# Altium project STM32F407ZGT6.PrjPcb
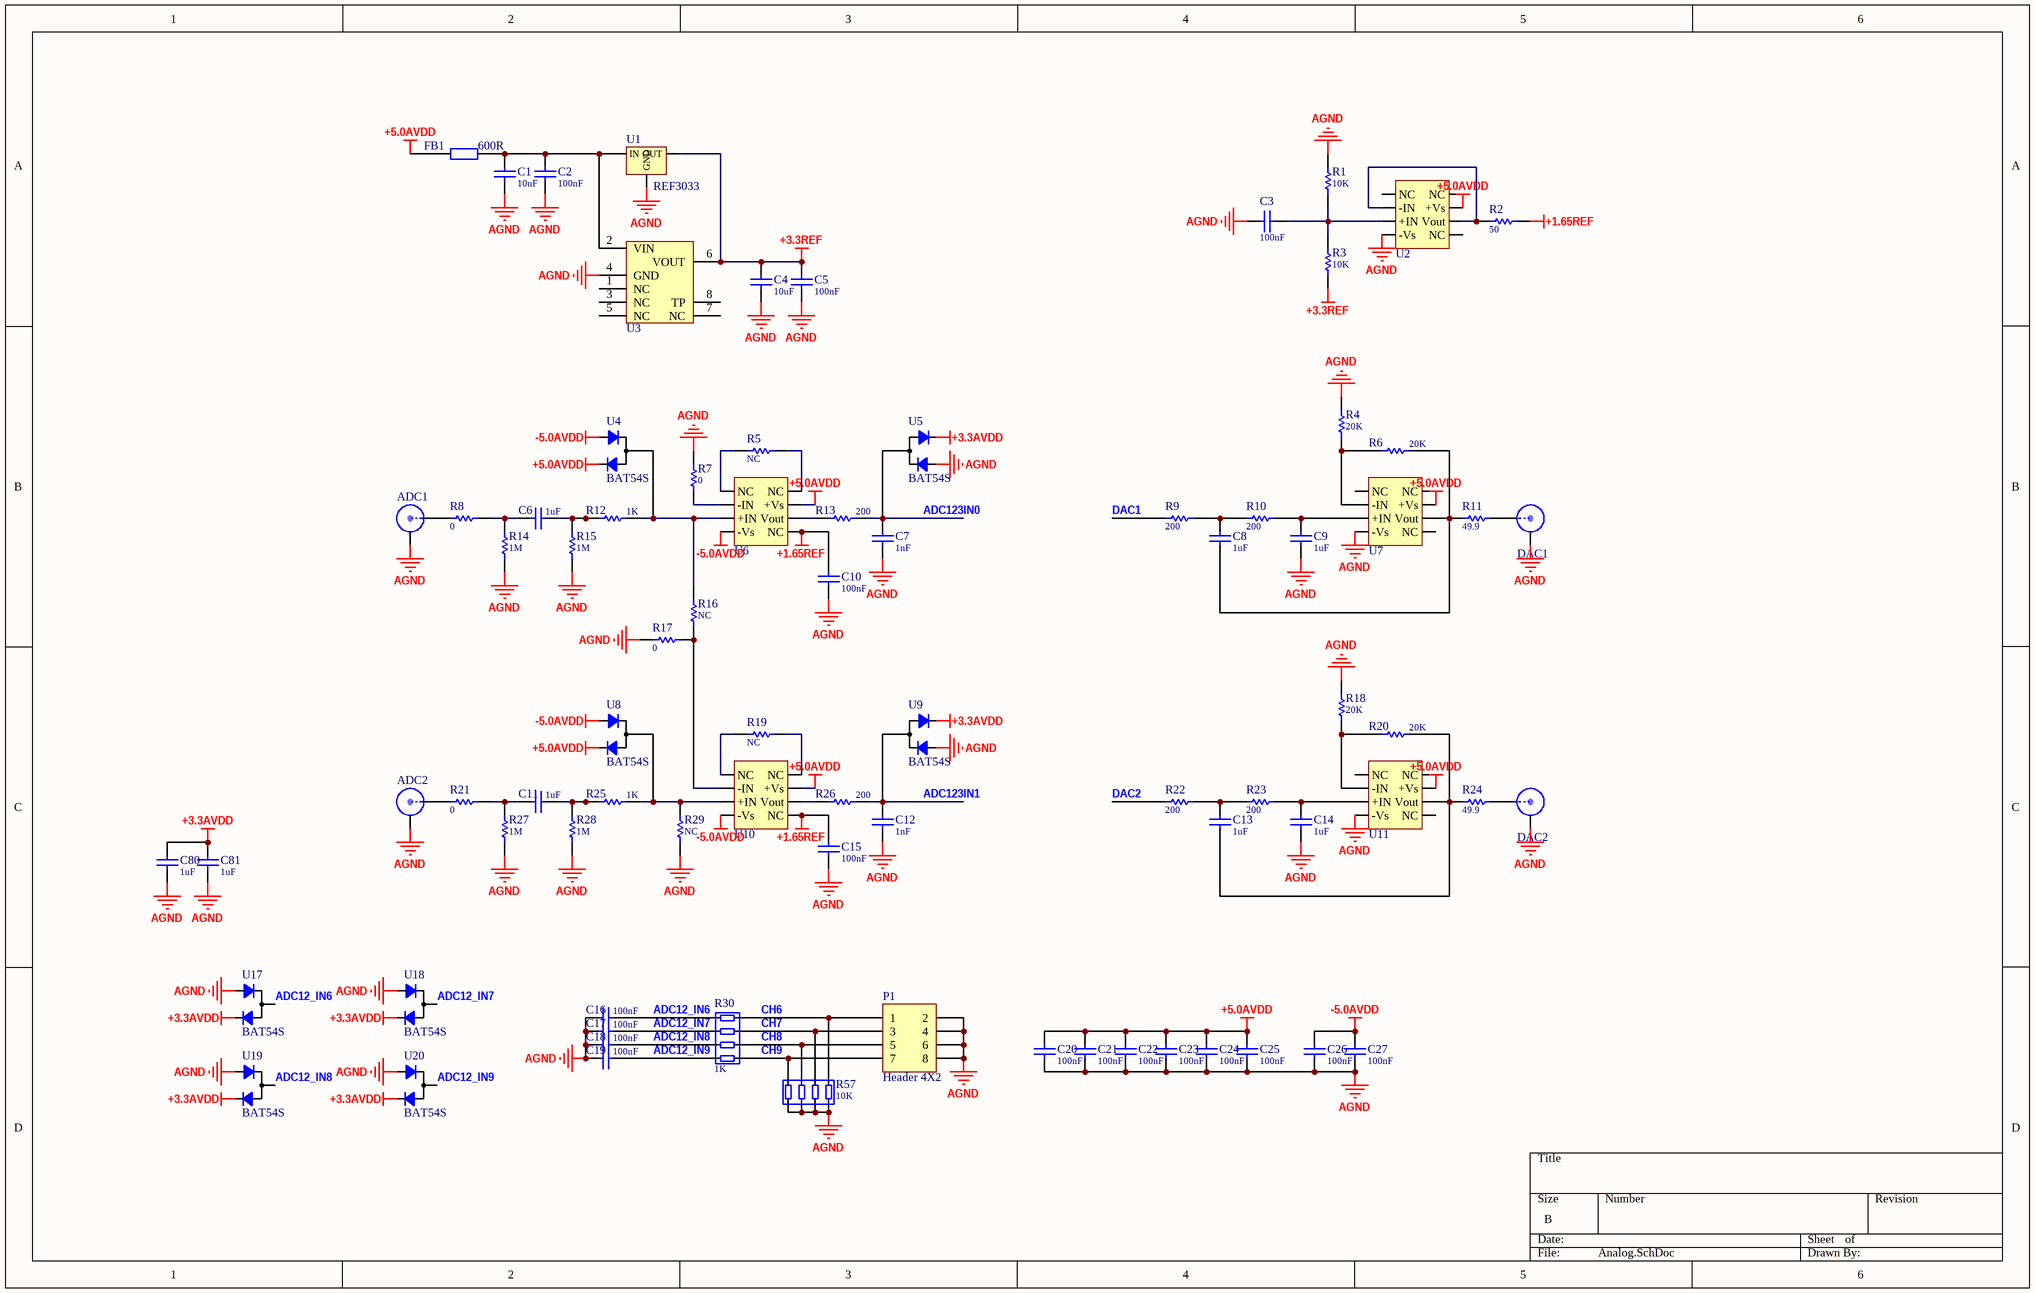
[diagram p0: Analog.SchDoc]
4 sheets, 225 parts. Net scope: global (net labels, ports and power ports of the same name join across sheets).
Board file: STM32F407ZGT6.PcbDoc
Sheets:
  Analog.SchDoc
  Power.SchDoc
  STM32F407ZGT6.SchDoc
  Ports.SchDoc

## Sheet Analog.SchDoc
size B

### Parts
ADC1  SMA  [SMA_ANGLE]  (value not drawn)
ADC2  SMA  [SMA_ANGLE]  (value not drawn)
C1  value 10uF  [C0603-L]  (hidden comment: Cap-S)
C2  value 100nF  [C0603-L]  (hidden comment: Cap-S)
C3  value 100nF  [C0603-L]  (hidden comment: Cap-S)
C4  value 10uF  [C0603-L]  (hidden comment: Cap-S)
C5  value 100nF  [C0603-L]  (hidden comment: Cap-S)
C6  value 1uF  [C0603-L]  (hidden comment: Cap-S)
C7  value 1nF  [C0603-L]  (hidden comment: Cap-S)
C8  value 1uF  [C0603-L]  (hidden comment: Cap-S)
C9  value 1uF  [C0603-L]  (hidden comment: Cap-S)
C10  value 100nF  [C0603-L]  (hidden comment: Cap-S)
C11  value 1uF  [C0603-L]  (hidden comment: Cap-S)
C12  value 1nF  [C0603-L]  (hidden comment: Cap-S)
C13  value 1uF  [C0603-L]  (hidden comment: Cap-S)
C14  value 1uF  [C0603-L]  (hidden comment: Cap-S)
C15  value 100nF  [C0603-L]  (hidden comment: Cap-S)
C16  value 100nF  [C0603-L]  (hidden comment: Cap-S)
C17  value 100nF  [C0603-L]  (hidden comment: Cap-S)
C18  value 100nF  [C0603-L]  (hidden comment: Cap-S)
C19  value 100nF  [C0603-L]  (hidden comment: Cap-S)
C20  value 100nF  [C0603-L]  (hidden comment: Cap-S)
C21  value 100nF  [C0603-L]  (hidden comment: Cap-S)
C22  value 100nF  [C0603-L]  (hidden comment: Cap-S)
C23  value 100nF  [C0603-L]  (hidden comment: Cap-S)
C24  value 100nF  [C0603-L]  (hidden comment: Cap-S)
C25  value 100nF  [C0603-L]  (hidden comment: Cap-S)
C26  value 100nF  [C0603-L]  (hidden comment: Cap-S)
C27  value 100nF  [C0603-L]  (hidden comment: Cap-S)
C80  value 1uF  [C0603-L]  (hidden comment: Cap-S)
C81  value 1uF  [C0603-L]  (hidden comment: Cap-S)
DAC1  SMA  [SMA_ANGLE]  (value not drawn)
DAC2  SMA  [SMA_ANGLE]  (value not drawn)
FB1  600R  [FB-0805]
P1  Header 4X2  [HDR2X4]
R1  value 10K  [R0603-L]  (hidden comment: R)
R2  value 50  [R0603-L]  (hidden comment: R)
R3  value 10K  [R0603-L]  (hidden comment: R)
R4  value 20K  [R0603-L]  (hidden comment: R)
R5  value NC  [R0603-L]  (hidden comment: R)
R6  value 20K  [R0603-L]  (hidden comment: R)
R7  value 0  [R0603-L]  (hidden comment: R)
R8  value 0  [R0603-L]  (hidden comment: R)
R9  value 200  [R0603-L]  (hidden comment: R)
R10  value 200  [R0603-L]  (hidden comment: R)
R11  value 49.9  [R0603-L]  (hidden comment: R)
R12  value 1K  [R0603-L]  (hidden comment: R)
R13  value 200  [R0603-L]  (hidden comment: R)
R14  value 1M  [R0603-L]  (hidden comment: R)
R15  value 1M  [R0603-L]  (hidden comment: R)
R16  value NC  [R0603-L]  (hidden comment: R)
R17  value 0  [R0603-L]  (hidden comment: R)
R18  value 20K  [R0603-L]  (hidden comment: R)
R19  value NC  [R0603-L]  (hidden comment: R)
R20  value 20K  [R0603-L]  (hidden comment: R)
R21  value 0  [R0603-L]  (hidden comment: R)
R22  value 200  [R0603-L]  (hidden comment: R)
R23  value 200  [R0603-L]  (hidden comment: R)
R24  value 49.9  [R0603-L]  (hidden comment: R)
R25  value 1K  [R0603-L]  (hidden comment: R)
R26  value 200  [R0603-L]  (hidden comment: R)
R27  value 1M  [R0603-L]  (hidden comment: R)
R28  value 1M  [R0603-L]  (hidden comment: R)
R29  value NC  [R0603-L]  (hidden comment: R)
R30  value 1K  [R0603X4]  (hidden comment: R)
R57  value 10K  [R0603X4]  (hidden comment: R)
U1  REF3033  [SOT23-3_N]
U2  OPA657  [SOIC-8_N]  (value not drawn)
U3  ADR45xx  [SOIC-8_N]  (value not drawn)
U4  BAT54S  [SOT-23-3]
U5  BAT54S  [SOT-23-3]
U6  OPA657  [SOIC-8_N]  (value not drawn)
U7  OPA657  [SOIC-8_N]  (value not drawn)
U8  BAT54S  [SOT-23-3]
U9  BAT54S  [SOT-23-3]
U10  OPA657  [SOIC-8_N]  (value not drawn)
U11  OPA657  [SOIC-8_N]  (value not drawn)
U17  BAT54S  [SOT-23-3]
U18  BAT54S  [SOT-23-3]
U19  BAT54S  [SOT-23-3]
U20  BAT54S  [SOT-23-3]

### Nets
+1.65REF: C10.1 C15.1 R2.1 U6.5(NC) U10.5(NC)
+3.3AVDD: C80.1 C81.1 U5.3 U9.3 U17.3 U18.3 U19.3 U20.3
+3.3REF: C4.2 C5.2 R3.1 U1.2(OUT) U3.6(VOUT)
+5.0AVDD: C20.1 C21.1 C22.1 C23.1 C24.1 C25.1 FB1.1 U2.7(+Vs) U4.3 U6.7(+Vs) U7.7(+Vs) U8.3 U10.7(+Vs) U11.7(+Vs)
-5.0AVDD: C26.1 C27.1 U4.1 U6.4(-Vs) U8.1 U10.4(-Vs)
AGND: ADC1.2 ADC2.2 C1.1 C2.1 C3.2 C4.1 C5.1 C7.1 C9.2 C10.2 C12.1 C14.2 C15.2 C16.2 C17.2 C18.2 C19.2 C20.2 C21.2 C22.2 C23.2 C24.2 C25.2 C26.2 C27.2 C80.2 C81.2 DAC1.2 DAC2.2 P1.2 P1.4 P1.6 P1.8 R1.2 R4.2 R7.2 R14.1 R15.1 R17.2 R18.2 R27.1 R28.1 R29.2 R57.5 R57.6 R57.7 R57.8 U1.3(GND) U2.4(-Vs) U3.4(GND) U5.1 U7.4(-Vs) U9.1 U11.4(-Vs) U17.1 U18.1 U19.1 U20.1
ADC12_IN6: C16.1 R30.8 U17.2
ADC12_IN7: C17.1 R30.7 U18.2
ADC12_IN8: C18.1 R30.6 U19.2
ADC12_IN9: C19.1 R30.5 U20.2
ADC123IN0: C7.2 R13.2 U5.2
ADC123IN1: C12.2 R26.2 U9.2
CH6: P1.1 R30.1 R57.4
CH7: P1.3 R30.2 R57.3
CH8: P1.5 R30.3 R57.2
CH9: P1.7 R30.4 R57.1
DAC1: R9.2
DAC2: R22.2
NetADC1_1: ADC1.1 R8.2
NetADC2_1: ADC2.1 R21.2
NetC1_2: C1.2 C2.2 FB1.2 U1.1(IN) U3.2(VIN)
NetC3_1: C3.1 R1.1 R3.2 U2.3(+IN)
NetC6_1: C6.1 R12.1 R15.2
NetC6_2: C6.2 R8.1 R14.2
NetC8_1: C8.1 R9.1 R10.2
NetC8_2: C8.2 R6.2 R11.2 U7.6(Vout)
NetC9_1: C9.1 R10.1 U7.3(+IN)
NetC11_1: C11.1 R25.1 R28.2
NetC11_2: C11.2 R21.1 R27.2
NetC13_1: C13.1 R22.1 R23.2
NetC13_2: C13.2 R20.2 R24.2 U11.6(Vout)
NetC14_1: C14.1 R23.1 U11.3(+IN)
NetDAC1_1: DAC1.1 R11.1
NetDAC2_1: DAC2.1 R24.1
NetR2_2: R2.2 U2.2(-IN) U2.6(Vout)
NetR4_1: R4.1 R6.1 U7.2(-IN)
NetR5_1: R5.1 U6.8(NC)
NetR5_2: R5.2 U6.1(NC)
NetR7_1: R7.1 U6.2(-IN)
NetR12_2: R12.2 R16.2 U4.2 U6.3(+IN)
NetR13_1: R13.1 U6.6(Vout)
NetR16_1: R16.1 R17.1 U10.2(-IN)
NetR18_1: R18.1 R20.1 U11.2(-IN)
NetR19_1: R19.1 U10.8(NC)
NetR19_2: R19.2 U10.1(NC)
NetR25_2: R25.2 R29.1 U8.2 U10.3(+IN)
NetR26_1: R26.1 U10.6(Vout)

Not connected (* = marked no-connect by the designer): U2 1(NC) 5(NC) 8(NC); U3 1(NC) 3(NC) 5(NC) 7(NC) 8(TP); U7 1(NC) 5(NC) 8(NC); U11 1(NC) 5(NC) 8(NC)

### Library data of the parts
C1-C27 C80 C81 = Cap-S: 贴片瓷片电容
FB1 = FB
P1 = Header 4X2: Header, 4-Pin, Dual row; LatestRevisionDate: 17-Jul-2002; LatestRevisionNote: Re-released for DXP Platform.; Publisher: Altium Limited
R1-R29 = Res: 贴片电阻
R30 R57 = Res-4R: 排阻 4
U1 = REF3025: 采用 SOT23-3 封装的 2.5V 输出 50ppm/℃ 漂移 50uA 静态电流的（带隙）电压参考
U2 U6 U7 U10 U11 = OPA657: 1.6-GHz, Low-Noise, FET-Input Operational Amplifier; Manufacturer: Texas Instruments; PartNumber: OPA656U; 2nd Harmonic(dBc): 74; 3rd Harmonic(dBc): 100; @ MHz: 5; Acl, min stable gain(V/V): 1; BW @ Acl(MHz): 500; Diff Gain(%): 0.02; Diff Phase(deg): 0.05; Eco-Plan: Green (RoHS & no Sb/Br); Io(Typ)(mA): 70; Iq per channel(Max)(mA): 16; Slew Rate(Typ)(V/us): 290; Sub Family: High Output Current Amplifier (>=50mA), High Speed Amplifier (>=50MHz), Low Input Bias Current Amp (<=10pA); THD (Fc is 1 MHz)(Typ)(dB): -74; Vio(Max)(mV): 0.6; Vn at Flatband(Typ)(nV/rtHz): 7; Vs(Max)(V): 12; Vs(Min)(V): 10; DatasheetVersion: SBOS196G; PackageVersion: 4040047-3/M, 06/2011; PackageReference: D8; PackageDescription: 8-Pin Plastic Small Outline, Body 4.9 x 3.9 mm, Pitch 1.27 mm; Supplier 1: Digi-Key; Supplier Part Number 1: OPA656U-ND; Supplier 2: Farnell; Supplier Part Number 2: 1212322; Supplier 3: Newark; Supplier Part Number 3: 75C5137; Supplier 4: Mouser; Supplier Part Number 4: 595-OPA656U; Iib(Max)(nA): 0.02; Number of Channels: 1; Settling Time (0.1%)(Typ)(ns): 16; Mounting Technology: Surface Mount; Code_JEDEC: MS-012; ComponentLink1Description: Manufacturer URL; ComponentLink1URL: http://www.ti.com/; ComponentLink2Description: Datasheet; ComponentLink2URL: http://www.ti.com/general/docs/lit/getliterature.tsp?genericPartNumber=OPA656&fileType=pdf; ComponentLink3Description: Package Specification; ComponentLink3URL: http://www.ti.com/litv/pdf/msoi002j
U3 = ADR45xx: 超低噪声、高精度  基准电压源

## Sheet Power.SchDoc
size A4
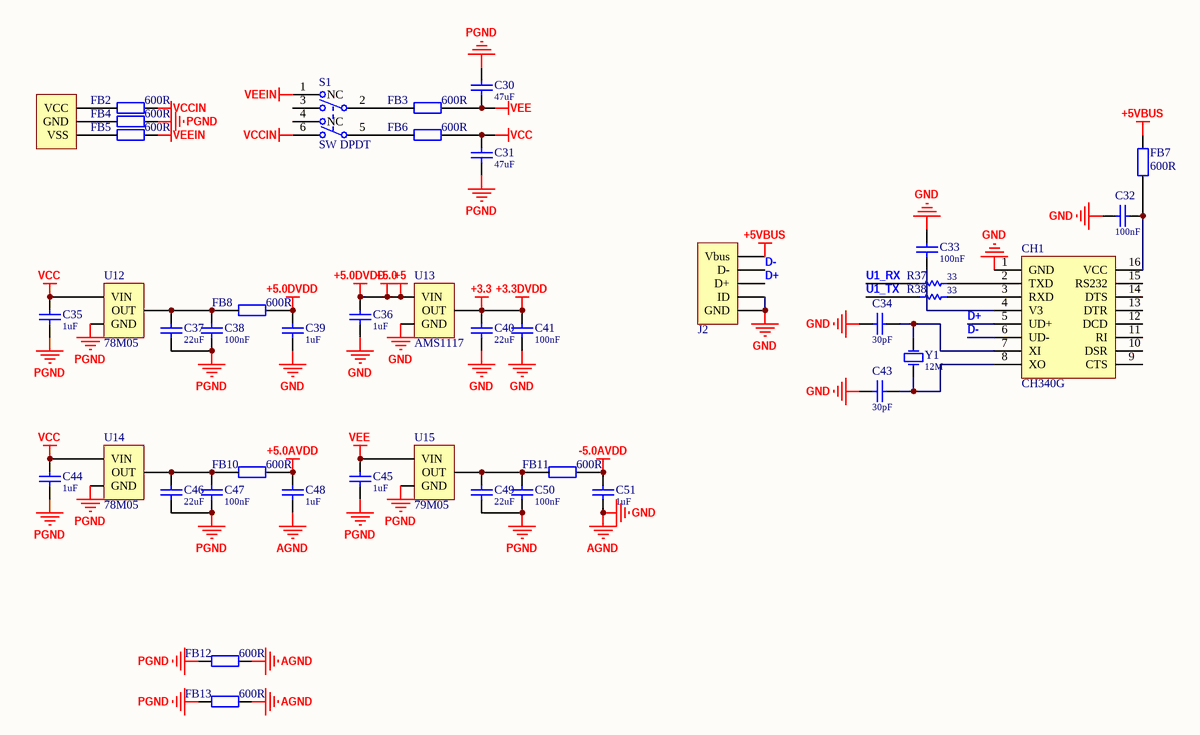
[diagram p1: Power.SchDoc]

### Parts
C30  value 47uF  [C0805-L]  (hidden comment: Cap-S)
C31  value 47uF  [C0805-L]  (hidden comment: Cap-S)
C32  value 100nF  [C0603-L]  (hidden comment: Cap-S)
C33  value 100nF  [C0603-L]  (hidden comment: Cap-S)
C34  value 30pF  [C0603-L]  (hidden comment: Cap-S)
C35  value 1uF  [C0603-L]  (hidden comment: Cap-S)
C36  value 1uF  [C0603-L]  (hidden comment: Cap-S)
C37  value 22uF  [C0805-L]  (hidden comment: Cap-S)
C38  value 100nF  [C0603-L]  (hidden comment: Cap-S)
C39  value 1uF  [C0603-L]  (hidden comment: Cap-S)
C40  value 22uF  [C0805-L]  (hidden comment: Cap-S)
C41  value 100nF  [C0603-L]  (hidden comment: Cap-S)
C43  value 30pF  [C0603-L]  (hidden comment: Cap-S)
C44  value 1uF  [C0603-L]  (hidden comment: Cap-S)
C45  value 1uF  [C0603-L]  (hidden comment: Cap-S)
C46  value 22uF  [C0805-L]  (hidden comment: Cap-S)
C47  value 100nF  [C0603-L]  (hidden comment: Cap-S)
C48  value 1uF  [C0603-L]  (hidden comment: Cap-S)
C49  value 22uF  [C0805-L]  (hidden comment: Cap-S)
C50  value 100nF  [C0603-L]  (hidden comment: Cap-S)
C51  value 1uF  [C0603-L]  (hidden comment: Cap-S)
CH1  CH340G  [SOP-16]
FB2  600R  [FB-0805]
FB3  600R  [FB-0805]
FB4  600R  [FB-0805]
FB5  600R  [FB-0805]
FB6  600R  [FB-0805]
FB7  600R  [FB-0805]
FB8  600R  [FB-0805]
FB10  600R  [FB-0805]
FB11  600R  [FB-0805]
FB12  600R  [FB-0805]
FB13  600R  [FB-0805]
J1  Power-3P  [SIPA03]  (value not drawn)
J2  USB_Mini/Micro  [USB_MINI_B-L]  (value not drawn)
R37  value 33  [R0603-L]  (hidden comment: R)
R38  value 33  [R0603-L]  (hidden comment: R)
S1  SW DPDT  [SW_DPDT]
U12  78M05  [TO-252]
U13  AMS1117  [SOT-223]
U14  78M05  [TO-252]
U15  79M05  [TO-252]
Y1  value 12M  [XTAL-PB2-SMD]  (hidden comment: XTAL)

### Nets
+3.3: C40.2 C41.2 U13.2(OUT)  [also labelled +3.3DVDD]
+5: C36.2 C39.2 FB8.2 U13.3(VIN)  [also labelled +5.0, +5.0DVDD]
+5.0AVDD: C48.2 FB10.2
+5VBUS: FB7.2 J2.1(Vbus)
-5.0AVDD: C51.2 FB11.2
AGND: C32.1 C33.1 C34.1 C36.1 C39.1 C40.1 C41.1 C43.1 C48.1 C51.1 CH1.1(GND) FB12.2 FB13.2 J2.4(ID) J2.5(GND) U13.1(GND)  [also labelled GND]
PGND: C30.2 C31.2 C35.1 C37.1 C38.1 C44.1 C45.1 C46.1 C47.1 C49.1 C50.1 FB4.2 FB12.1 FB13.1 U12.2(GND) U14.2(GND) U15.1(GND)
VCC: C31.1 C35.2 C44.2 FB6.2 U12.1(VIN) U14.1(VIN)
VCCIN: FB2.2 S1.6(NO2)
VEE: C30.1 C45.2 FB3.2 U15.2(VIN)
VEEIN: FB5.2 S1.1(NC)
D+: CH1.5(UD+) J2.3(D+)
D-: CH1.6(UD-) J2.2(D-)
U1_RX: R37.1
U1_TX: R38.1
NetC32_2: C32.2 CH1.16(VCC) FB7.1
NetC33_2: C33.2 CH1.4(V3)
NetC34_2: C34.2 CH1.7(XI) Y1.2(OSC2)
NetC37_2: C37.2 C38.2 FB8.1 U12.3(OUT)
NetC43_2: C43.2 CH1.8(XO) Y1.1(OSC1)
NetC46_2: C46.2 C47.2 FB10.1 U14.3(OUT)
NetC49_2: C49.2 C50.2 FB11.1 U15.3(OUT)
NetCH1_2: CH1.2(TXD) R37.2
NetCH1_3: CH1.3(RXD) R38.2
NetFB2_1: FB2.1 J1.1(VCC)
NetFB3_1: FB3.1 S1.2
NetFB4_1: FB4.1 J1.2(GND)
NetFB5_1: FB5.1 J1.3(VSS)
NetFB6_1: FB6.1 S1.5(COMMON2)

Not connected (* = marked no-connect by the designer): CH1 9(CTS) 10(DSR) 11(RI) 12(DCD) 13(DTR) 14(DTS) 15(RS232); S1 3(NO1) 4(NC)

### Library data of the parts
C30-C41 C43-C51 = Cap-S: 贴片瓷片电容
CH1 = CH340G: SOP16
FB2-FB8 FB10-FB13 = FB
J1 = Power-3P: 供电端子
J2 = USB: Mini/Micro USB母口
R37 R38 = Res: 贴片电阻
S1 = SW DPDT: 自锁开关; Published: 24-Mar-1999; LatestRevisionDate: 29-May-2009; LatestRevisionNote: IPC-7351 Footprint Added.; PackageVersion: Mar-2001; PackageReference: SOT23-6; Publisher: Altium Limited; PackageDescription: 6-Pin SOT-23 Package 0.95 mm Pitch, 2.7 mm Lead Span; Code_JEITA: SC-74; Code_IPC: SOT26A-6
Y1 = XTAL: 晶振

## Sheet STM32F407ZGT6.SchDoc
size C
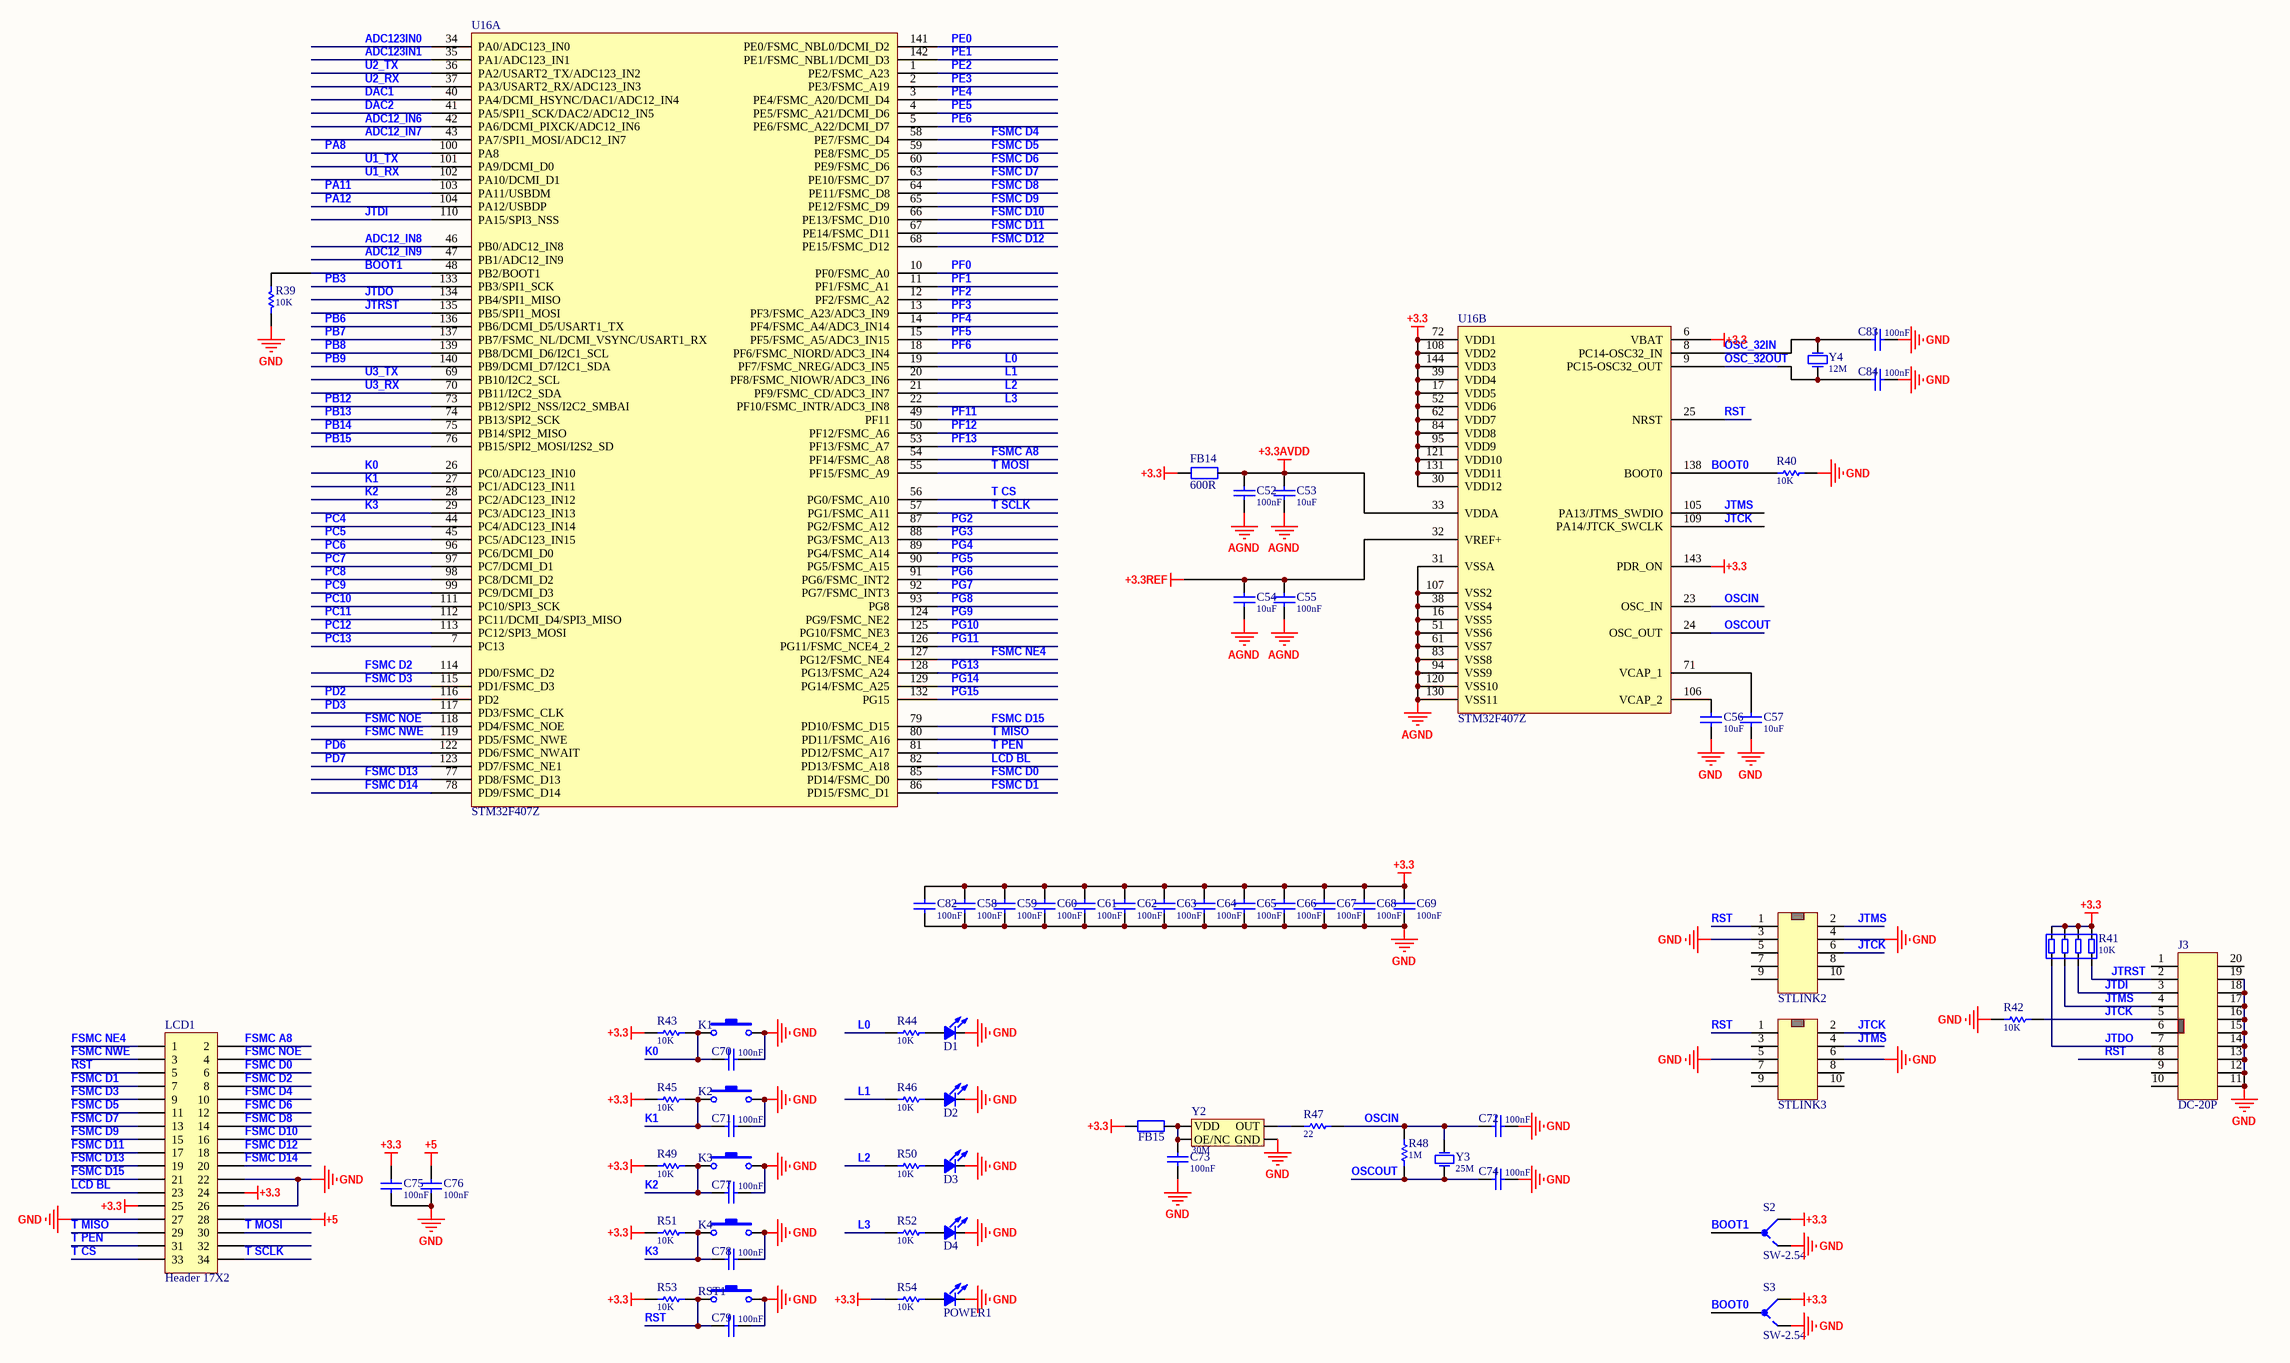
[diagram p2: STM32F407ZGT6.SchDoc]

### Parts
C52  value 100nF  [C0603-L]  (hidden comment: Cap-S)
C53  value 10uF  [C0603-L]  (hidden comment: Cap-S)
C54  value 10uF  [C0603-L]  (hidden comment: Cap-S)
C55  value 100nF  [C0603-L]  (hidden comment: Cap-S)
C56  value 10uF  [C0603-L]  (hidden comment: Cap-S)
C57  value 10uF  [C0603-L]  (hidden comment: Cap-S)
C58  value 100nF  [C0603-L]  (hidden comment: Cap-S)
C59  value 100nF  [C0603-L]  (hidden comment: Cap-S)
C60  value 100nF  [C0603-L]  (hidden comment: Cap-S)
C61  value 100nF  [C0603-L]  (hidden comment: Cap-S)
C62  value 100nF  [C0603-L]  (hidden comment: Cap-S)
C63  value 100nF  [C0603-L]  (hidden comment: Cap-S)
C64  value 100nF  [C0603-L]  (hidden comment: Cap-S)
C65  value 100nF  [C0603-L]  (hidden comment: Cap-S)
C66  value 100nF  [C0603-L]  (hidden comment: Cap-S)
C67  value 100nF  [C0603-L]  (hidden comment: Cap-S)
C68  value 100nF  [C0603-L]  (hidden comment: Cap-S)
C69  value 100nF  [C0603-L]  (hidden comment: Cap-S)
C70  value 100nF  [C0603-L]  (hidden comment: Cap-S)
C71  value 100nF  [C0603-L]  (hidden comment: Cap-S)
C72  value 100nF  [C0603-L]  (hidden comment: Cap-S)
C73  value 100nF  [C0603-L]  (hidden comment: Cap-S)
C74  value 100nF  [C0603-L]  (hidden comment: Cap-S)
C75  value 100nF  [C0603-L]  (hidden comment: Cap-S)
C76  value 100nF  [C0603-L]  (hidden comment: Cap-S)
C77  value 100nF  [C0603-L]  (hidden comment: Cap-S)
C78  value 100nF  [C0603-L]  (hidden comment: Cap-S)
C79  value 100nF  [C0603-L]  (hidden comment: Cap-S)
C82  value 100nF  [C0603-L]  (hidden comment: Cap-S)
C83  value 100nF  [C0603-L]  (hidden comment: Cap-S)
C84  value 100nF  [C0603-L]  (hidden comment: Cap-S)
D1  LED  [Led-0805_M]  (value not drawn)
D2  LED  [Led-0805_M]  (value not drawn)
D3  LED  [Led-0805_M]  (value not drawn)
D4  LED  [Led-0805_M]  (value not drawn)
FB14  600R  [FB-0603]
FB15  FB  [FB0805]  (value not drawn)
J3  DC-20P  [DC-20P]
K1  SW-PB2  [SW-PB2-SMD]  (value not drawn)
K2  SW-PB2  [SW-PB2-SMD]  (value not drawn)
K3  SW-PB2  [SW-PB2-SMD]  (value not drawn)
K4  SW-PB2  [SW-PB2-SMD]  (value not drawn)
LCD1  Header 17X2  [HDR2X17]
POWER1  LED  [Led-0805_M]  (value not drawn)
R39  value 10K  [R0603-L]  (hidden comment: R)
R40  value 10K  [R0603-L]  (hidden comment: R)
R41  value 10K  [R0603X4]  (hidden comment: R)
R42  value 10K  [R0603-L]  (hidden comment: R)
R43  value 10K  [R0603-L]  (hidden comment: R)
R44  value 10K  [R0603-L]  (hidden comment: R)
R45  value 10K  [R0603-L]  (hidden comment: R)
R46  value 10K  [R0603-L]  (hidden comment: R)
R47  value 22  [R0603-L]  (hidden comment: R)
R48  value 1M  [R0603-L]  (hidden comment: R)
R49  value 10K  [R0603-L]  (hidden comment: R)
R50  value 10K  [R0603-L]  (hidden comment: R)
R51  value 10K  [R0603-L]  (hidden comment: R)
R52  value 10K  [R0603-L]  (hidden comment: R)
R53  value 10K  [R0603-L]  (hidden comment: R)
R54  value 10K  [R0603-L]  (hidden comment: R)
RST1  SW-PB2  [SW-PB2-SMD]  (value not drawn)
S2  SW-2.54  [SW-2.54-3PDIP]
S3  SW-2.54  [SW-2.54-3PDIP]
STLINK2  JTAG  [JTAG-2.56_10]  (value not drawn)
STLINK3  JTAG  [JTAG-2.56_10]  (value not drawn)
U16  STM32F407Z  [TQFP-144]  (parts A,B of 2)
Y2  value 30M  [XTAL-7050_M]  (hidden comment: XTALS)
Y3  value 25M  [XTAL-PB2-SMD]  (hidden comment: XTAL)
Y4  value 12M  [XTAL-32768]  (hidden comment: XTAL)

### Nets
+3.3: C58.2 C59.2 C60.2 C61.2 C62.2 C63.2 C64.2 C65.2 C66.2 C67.2 C68.2 C69.2 C75.2 C82.2 FB14.2 FB15.1 LCD1.24 LCD1.25 R41.5 R41.6 R41.7 R41.8 R43.1 R45.1 R49.1 R51.1 R53.1 R54.1 S2.1 S3.1 U16.6(VBAT) U16.17(VDD5) U16.30(VDD12) U16.39(VDD4) U16.52(VDD6) U16.62(VDD7) U16.72(VDD1) U16.84(VDD8) U16.95(VDD9) U16.108(VDD2) U16.121(VDD10) U16.131(VDD11) U16.143(PDR_ON) U16.144(VDD3)
+3.3AVDD: C52.2 C53.2 FB14.1 U16.33(VDDA)
+3.3REF: C54.2 C55.2 U16.32(VREF+)
+5: C76.2 LCD1.28
AGND: C52.1 C53.1 C54.1 C55.1 C56.1 C57.1 C58.1 C59.1 C60.1 C61.1 C62.1 C63.1 C64.1 C65.1 C66.1 C67.1 C68.1 C69.1 C70.1 C71.1 C72.1 C73.2 C74.1 C75.1 C76.1 C77.1 C78.1 C79.1 C82.1 C83.1 C84.1 D1.2 D2.2 D3.2 D4.2 J3.11 J3.12 J3.13 J3.14 J3.15 J3.16 J3.17 J3.18 J3.19 K1.2 K2.2 K3.2 K4.2 LCD1.22 LCD1.26 LCD1.27 POWER1.2 R39.1 R40.1 R42.2 RST1.2 S2.3 S3.3 STLINK2.3 STLINK2.4 STLINK3.5 STLINK3.6 U16.16(VSS5) U16.31(VSSA) U16.38(VSS4) U16.51(VSS6) U16.61(VSS7) U16.83(VSS8) U16.94(VSS9) U16.107(VSS2) U16.120(VSS10) U16.130(VSS11) Y2.2(GND)  [also labelled GND]
ADC12_IN6: U16.42(PA6/DCMI_PIXCK/ADC12_IN6)
ADC12_IN7: U16.43(PA7/SPI1_MOSI/ADC12_IN7)
ADC12_IN8: U16.46(PB0/ADC12_IN8)
ADC12_IN9: U16.47(PB1/ADC12_IN9)
ADC123IN0: U16.34(PA0/ADC123_IN0)
ADC123IN1: U16.35(PA1/ADC123_IN1)
BOOT0: R40.2 S3.2 U16.138(BOOT0)
BOOT1: R39.2 S2.2 U16.48(PB2/BOOT1)
DAC1: U16.40(PA4/DCMI_HSYNC/DAC1/ADC12_IN4)
DAC2: U16.41(PA5/SPI1_SCK/DAC2/ADC12_IN5)
FSMC A8: LCD1.2 U16.54(PF14/FSMC_A8)
FSMC D0: LCD1.6 U16.85(PD14/FSMC_D0)
FSMC D1: LCD1.7 U16.86(PD15/FSMC_D1)
FSMC D2: LCD1.8 U16.114(PD0/FSMC_D2)
FSMC D3: LCD1.9 U16.115(PD1/FSMC_D3)
FSMC D4: LCD1.10 U16.58(PE7/FSMC_D4)
FSMC D5: LCD1.11 U16.59(PE8/FSMC_D5)
FSMC D6: LCD1.12 U16.60(PE9/FSMC_D6)
FSMC D7: LCD1.13 U16.63(PE10/FSMC_D7)
FSMC D8: LCD1.14 U16.64(PE11/FSMC_D8)
FSMC D9: LCD1.15 U16.65(PE12/FSMC_D9)
FSMC D10: LCD1.16 U16.66(PE13/FSMC_D10)
FSMC D11: LCD1.17 U16.67(PE14/FSMC_D11)
FSMC D12: LCD1.18 U16.68(PE15/FSMC_D12)
FSMC D13: LCD1.19 U16.77(PD8/FSMC_D13)
FSMC D14: LCD1.20 U16.78(PD9/FSMC_D14)
FSMC D15: LCD1.21 U16.79(PD10/FSMC_D15)
FSMC NE4: LCD1.1 U16.127(PG12/FSMC_NE4)
FSMC NOE: LCD1.4 U16.118(PD4/FSMC_NOE)
FSMC NWE: LCD1.3 U16.119(PD5/FSMC_NWE)
JTCK: J3.5 R42.1 STLINK2.6 STLINK3.2 U16.109(PA14/JTCK_SWCLK)
JTDI: J3.3 R41.3 U16.110(PA15/SPI3_NSS)
JTDO: J3.7 R41.1 U16.134(PB4/SPI1_MISO)
JTMS: J3.4 R41.2 STLINK2.2 STLINK3.4 U16.105(PA13/JTMS_SWDIO)
JTRST: J3.2 R41.4 U16.135(PB5/SPI1_MOSI)
K0: C70.2 K1.1 R43.2 U16.26(PC0/ADC123_IN10)
K1: C71.2 K2.1 R45.2 U16.27(PC1/ADC123_IN11)
K2: C77.2 K3.1 R49.2 U16.28(PC2/ADC123_IN12)
K3: C78.2 K4.1 R51.2 U16.29(PC3/ADC123_IN13)
L0: R44.1 U16.19(PF7/FSMC_NREG/ADC3_IN5)
L1: R46.1 U16.20(PF8/FSMC_NIOWR/ADC3_IN6)
L2: R50.1 U16.21(PF9/FSMC_CD/ADC3_IN7)
L3: R52.1 U16.22(PF10/FSMC_INTR/ADC3_IN8)
LCD BL: LCD1.23 U16.82(PD13/FSMC_A18)
OSC_32IN: C83.2 U16.8(PC14-OSC32_IN) Y4.2(OSC2)
OSC_32OUT: C84.2 U16.9(PC15-OSC32_OUT) Y4.1(OSC1)
OSCIN: C72.2 R47.1 R48.2 U16.23(OSC_IN) Y3.2(OSC2)
OSCOUT: C74.2 R48.1 U16.24(OSC_OUT) Y3.1(OSC1)
PA8: U16.100(PA8)
PA11: U16.103(PA11/USBDM)
PA12: U16.104(PA12/USBDP)
PB3: U16.133(PB3/SPI1_SCK)
PB6: U16.136(PB6/DCMI_D5/USART1_TX)
PB7: U16.137(PB7/FSMC_NL/DCMI_VSYNC/USART1_RX)
PB8: U16.139(PB8/DCMI_D6/I2C1_SCL)
PB9: U16.140(PB9/DCMI_D7/I2C1_SDA)
PB12: U16.73(PB12/SPI2_NSS/I2C2_SMBAI)
PB13: U16.74(PB13/SPI2_SCK)
PB14: U16.75(PB14/SPI2_MISO)
PB15: U16.76(PB15/SPI2_MOSI/I2S2_SD)
PC4: U16.44(PC4/ADC123_IN14)
PC5: U16.45(PC5/ADC123_IN15)
PC6: U16.96(PC6/DCMI_D0)
PC7: U16.97(PC7/DCMI_D1)
PC8: U16.98(PC8/DCMI_D2)
PC9: U16.99(PC9/DCMI_D3)
PC10: U16.111(PC10/SPI3_SCK)
PC11: U16.112(PC11/DCMI_D4/SPI3_MISO)
PC12: U16.113(PC12/SPI3_MOSI)
PC13: U16.7(PC13)
PD2: U16.116(PD2)
PD3: U16.117(PD3/FSMC_CLK)
PD6: U16.122(PD6/FSMC_NWAIT)
PD7: U16.123(PD7/FSMC_NE1)
PE0: U16.141(PE0/FSMC_NBL0/DCMI_D2)
PE1: U16.142(PE1/FSMC_NBL1/DCMI_D3)
PE2: U16.1(PE2/FSMC_A23)
PE3: U16.2(PE3/FSMC_A19)
PE4: U16.3(PE4/FSMC_A20/DCMI_D4)
PE5: U16.4(PE5/FSMC_A21/DCMI_D6)
PE6: U16.5(PE6/FSMC_A22/DCMI_D7)
PF0: U16.10(PF0/FSMC_A0)
PF1: U16.11(PF1/FSMC_A1)
PF2: U16.12(PF2/FSMC_A2)
PF3: U16.13(PF3/FSMC_A23/ADC3_IN9)
PF4: U16.14(PF4/FSMC_A4/ADC3_IN14)
PF5: U16.15(PF5/FSMC_A5/ADC3_IN15)
PF6: U16.18(PF6/FSMC_NIORD/ADC3_IN4)
PF11: U16.49(PF11)
PF12: U16.50(PF12/FSMC_A6)
PF13: U16.53(PF13/FSMC_A7)
PG2: U16.87(PG2/FSMC_A12)
PG3: U16.88(PG3/FSMC_A13)
PG4: U16.89(PG4/FSMC_A14)
PG5: U16.90(PG5/FSMC_A15)
PG6: U16.91(PG6/FSMC_INT2)
PG7: U16.92(PG7/FSMC_INT3)
PG8: U16.93(PG8)
PG9: U16.124(PG9/FSMC_NE2)
PG10: U16.125(PG10/FSMC_NE3)
PG11: U16.126(PG11/FSMC_NCE4_2)
PG13: U16.128(PG13/FSMC_A24)
PG14: U16.129(PG14/FSMC_A25)
PG15: U16.132(PG15)
RST: C79.2 J3.8 LCD1.5 R53.2 RST1.1 STLINK2.1 STLINK3.1 U16.25(NRST)
T CS: LCD1.33 U16.56(PG0/FSMC_A10)
T MISO: LCD1.29 U16.80(PD11/FSMC_A16)
T MOSI: LCD1.30 U16.55(PF15/FSMC_A9)
T PEN: LCD1.31 U16.81(PD12/FSMC_A17)
T SCLK: LCD1.34 U16.57(PG1/FSMC_A11)
U1_RX: U16.102(PA10/DCMI_D1)
U1_TX: U16.101(PA9/DCMI_D0)
U2_RX: U16.37(PA3/USART2_RX/ADC123_IN3)
U2_TX: U16.36(PA2/USART2_TX/ADC123_IN2)
U3_RX: U16.70(PB11/I2C2_SDA)
U3_TX: U16.69(PB10/I2C2_SCL)
NetC56_2: C56.2 U16.106(VCAP_2)
NetC57_2: C57.2 U16.71(VCAP_1)
NetC73_1: C73.1 FB15.2 Y2.1(OE/NC) Y2.4(VDD)
NetD1_1: D1.1 R44.2
NetD2_1: D2.1 R46.2
NetD3_1: D3.1 R50.2
NetD4_1: D4.1 R52.2
NetPOWER1_1: POWER1.1 R54.2
NetR47_2: R47.2 Y2.3(OUT)

Not connected (* = marked no-connect by the designer): J3 1 6 9 10 20; LCD1 32; STLINK2 5 7 8 9 10; STLINK3 3 7 8 9 10

### Library data of the parts
C52-C79 C82-C84 = Cap-S: 贴片瓷片电容
D1-D4 POWER1 = LED: 发光二极管
FB14 = FB
FB15 = FB: 磁珠
K1-K4 RST1 = SW-PB2: 贴片式2脚微动开关
LCD1 = Header 17X2: Header, 17-Pin, Dual row; LatestRevisionDate: 17-Jul-2002; LatestRevisionNote: Re-released for DXP Platform.; Publisher: Altium Limited
R39 R40 R42-R54 = Res: 贴片电阻
R41 = Res-4R: 排阻 4
S2 S3 = SW-2.54-3P
STLINK2 STLINK3 = JTAG-2.56_2X5
U16 = STM32F407Z: STM32单片机144引脚
Y2 = XTALS: 贴片有源晶振
Y3 Y4 = XTAL: 晶振

## Sheet Ports.SchDoc
size A4
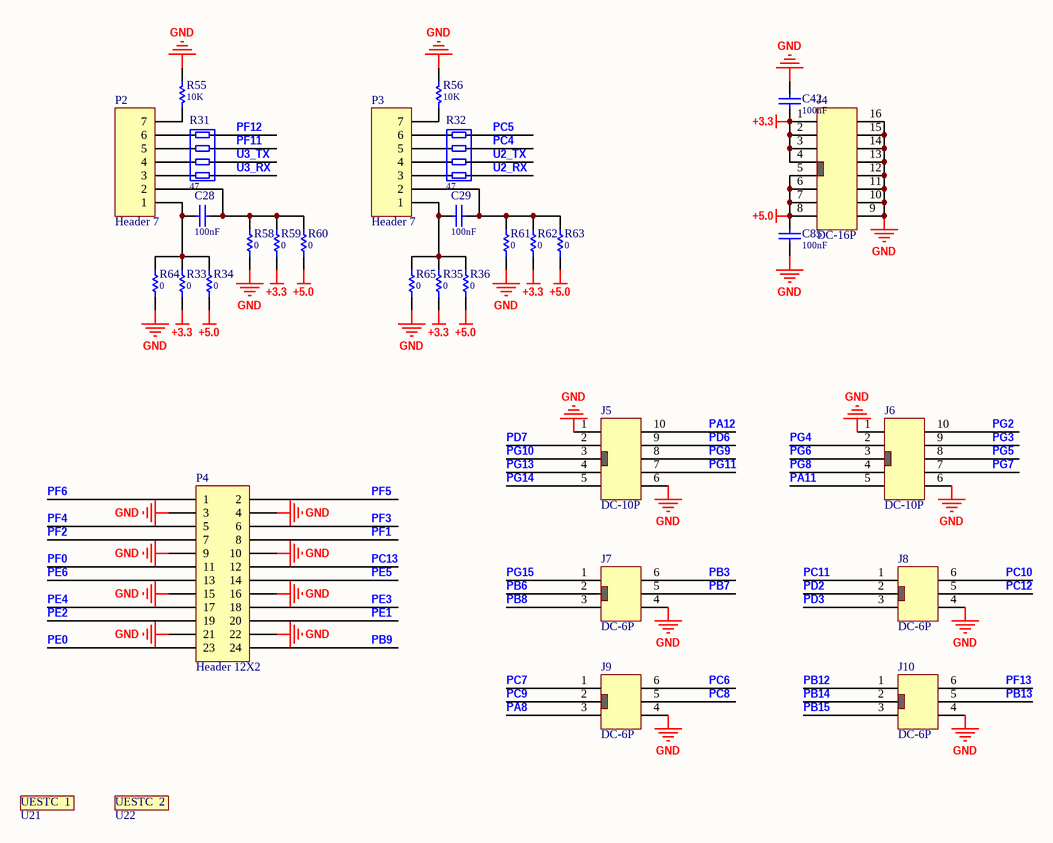
[diagram p3: Ports.SchDoc]

### Parts
C28  value 100nF  [C0603-L]  (hidden comment: Cap-S)
C29  value 100nF  [C0603-L]  (hidden comment: Cap-S)
C42  value 100nF  [C0603-L]  (hidden comment: Cap-S)
C85  value 100nF  [C0603-L]  (hidden comment: Cap-S)
J4  DC-16P  [DC-16P]
J5  DC-10P  [DC-10P]
J6  DC-10P  [DC-10P]
J7  DC-6P  [DC-6P]
J8  DC-6P  [DC-6P]
J9  DC-6P  [DC-6P]
J10  DC-6P  [DC-6P]
P2  Header 7  [HDR1X7]
P3  Header 7  [HDR1X7]
P4  Header 12X2  [HDR2X12]
R31  value 47  [R0603X4]  (hidden comment: R)
R32  value 47  [R0603X4]  (hidden comment: R)
R33  value 0  [R0603-L]  (hidden comment: R)
R34  value 0  [R0603-L]  (hidden comment: R)
R35  value 0  [R0603-L]  (hidden comment: R)
R36  value 0  [R0603-L]  (hidden comment: R)
R55  value 10K  [R0603-L]  (hidden comment: R)
R56  value 10K  [R0603-L]  (hidden comment: R)
R58  value 0  [R0603-L]  (hidden comment: R)
R59  value 0  [R0603-L]  (hidden comment: R)
R60  value 0  [R0603-L]  (hidden comment: R)
R61  value 0  [R0603-L]  (hidden comment: R)
R62  value 0  [R0603-L]  (hidden comment: R)
R63  value 0  [R0603-L]  (hidden comment: R)
R64  value 0  [R0603-L]  (hidden comment: R)
R65  value 0  [R0603-L]  (hidden comment: R)
U21  UESTC  1  [UESTC]  (value not drawn)
U22  UESTC  2  [UESTC  2]  (value not drawn)

### Nets
+3.3: C42.2 J4.1 J4.2 J4.3 J4.4 R33.1 R35.1 R59.1 R62.1
+5.0: C85.1 J4.5 J4.6 J4.7 J4.8 R34.1 R36.1 R60.1 R63.1  [project net +5]
GND: C42.1 C85.2 J4.9 J4.10 J4.11 J4.12 J4.13 J4.14 J4.15 J4.16 J5.1 J5.6 J6.1 J6.6 J7.4 J8.4 J9.4 J10.4 P4.3 P4.4 P4.9 P4.10 P4.15 P4.16 P4.21 P4.22 R55.1 R56.1 R58.1 R61.1 R64.1 R65.1  [project net AGND]
PA8: J9.3
PA11: J6.5
PA12: J5.10
PB3: J7.6
PB6: J7.2
PB7: J7.5
PB8: J7.3
PB9: P4.24
PB12: J10.1
PB13: J10.5
PB14: J10.2
PB15: J10.3
PC4: R32.3
PC5: R32.4
PC6: J9.6
PC7: J9.1
PC8: J9.5
PC9: J9.2
PC10: J8.6
PC11: J8.1
PC12: J8.5
PC13: P4.12
PD2: J8.2
PD3: J8.3
PD6: J5.9
PD7: J5.2
PE0: P4.23
PE1: P4.20
PE2: P4.19
PE3: P4.18
PE4: P4.17
PE5: P4.14
PE6: P4.13
PF0: P4.11
PF1: P4.8
PF2: P4.7
PF3: P4.6
PF4: P4.5
PF5: P4.2
PF6: P4.1
PF11: R31.3
PF12: R31.4
PF13: J10.6
PG2: J6.10
PG3: J6.9
PG4: J6.2
PG5: J6.8
PG6: J6.3
PG7: J6.7
PG8: J6.4
PG9: J5.8
PG10: J5.3
PG11: J5.7
PG13: J5.4
PG14: J5.5
PG15: J7.1
U2_RX: R32.1
U2_TX: R32.2
U3_RX: R31.1
U3_TX: R31.2
NetC28_1: C28.1 P2.2 R58.2 R59.2 R60.2
NetC28_2: C28.2 P2.1 R33.2 R34.2 R64.2
NetC29_1: C29.1 P3.2 R61.2 R62.2 R63.2
NetC29_2: C29.2 P3.1 R35.2 R36.2 R65.2
NetP2_3: P2.3 R31.8
NetP2_4: P2.4 R31.7
NetP2_5: P2.5 R31.6
NetP2_6: P2.6 R31.5
NetP2_7: P2.7 R55.2
NetP3_3: P3.3 R32.8
NetP3_4: P3.4 R32.7
NetP3_5: P3.5 R32.6
NetP3_6: P3.6 R32.5
NetP3_7: P3.7 R56.2

### Library data of the parts
C28 C29 C42 C85 = Cap-S: 贴片瓷片电容
P2 P3 = Header 7: Header, 7-Pin; LatestRevisionDate: 17-Jul-2002; LatestRevisionNote: Re-released for DXP Platform.; Publisher: Altium Limited
P4 = Header 12X2: Header, 12-Pin, Dual row; LatestRevisionDate: 17-Jul-2002; LatestRevisionNote: Re-released for DXP Platform.; Publisher: Altium Limited
R31 R32 = Res-4R: 排阻 4
R33-R36 R55 R56 R58-R65 = Res: 贴片电阻

## Nets that join several sheets
+3.3: Power (C40.2 C41.2 U13.2), STM32F407ZGT6 (44 pins), Ports (9 pins)
+3.3AVDD: Analog (8 pins), STM32F407ZGT6 (C52.2 C53.2 FB14.1 U16.33)
+3.3REF: Analog (5 pins), STM32F407ZGT6 (C54.2 C55.2 U16.32)
+5: Power (C36.2 C39.2 FB8.2 U13.3), STM32F407ZGT6 (C76.2 LCD1.28), Ports (9 pins)
+5.0AVDD: Analog (14 pins), Power (C48.2 FB10.2)
-5.0AVDD: Analog (6 pins), Power (C51.2 FB11.2)
AGND: Analog (58 pins), Power (16 pins), STM32F407ZGT6 (73 pins), Ports (32 pins)
ADC12_IN6: Analog (C16.1 R30.8 U17.2), STM32F407ZGT6 (U16.42)
ADC12_IN7: Analog (C17.1 R30.7 U18.2), STM32F407ZGT6 (U16.43)
ADC12_IN8: Analog (C18.1 R30.6 U19.2), STM32F407ZGT6 (U16.46)
ADC12_IN9: Analog (C19.1 R30.5 U20.2), STM32F407ZGT6 (U16.47)
ADC123IN0: Analog (C7.2 R13.2 U5.2), STM32F407ZGT6 (U16.34)
ADC123IN1: Analog (C12.2 R26.2 U9.2), STM32F407ZGT6 (U16.35)
DAC1: Analog (R9.2), STM32F407ZGT6 (U16.40)
DAC2: Analog (R22.2), STM32F407ZGT6 (U16.41)
PA8: STM32F407ZGT6 (U16.100), Ports (J9.3)
PA11: STM32F407ZGT6 (U16.103), Ports (J6.5)
PA12: STM32F407ZGT6 (U16.104), Ports (J5.10)
PB3: STM32F407ZGT6 (U16.133), Ports (J7.6)
PB6: STM32F407ZGT6 (U16.136), Ports (J7.2)
PB7: STM32F407ZGT6 (U16.137), Ports (J7.5)
PB8: STM32F407ZGT6 (U16.139), Ports (J7.3)
PB9: STM32F407ZGT6 (U16.140), Ports (P4.24)
PB12: STM32F407ZGT6 (U16.73), Ports (J10.1)
PB13: STM32F407ZGT6 (U16.74), Ports (J10.5)
PB14: STM32F407ZGT6 (U16.75), Ports (J10.2)
PB15: STM32F407ZGT6 (U16.76), Ports (J10.3)
PC4: STM32F407ZGT6 (U16.44), Ports (R32.3)
PC5: STM32F407ZGT6 (U16.45), Ports (R32.4)
PC6: STM32F407ZGT6 (U16.96), Ports (J9.6)
PC7: STM32F407ZGT6 (U16.97), Ports (J9.1)
PC8: STM32F407ZGT6 (U16.98), Ports (J9.5)
PC9: STM32F407ZGT6 (U16.99), Ports (J9.2)
PC10: STM32F407ZGT6 (U16.111), Ports (J8.6)
PC11: STM32F407ZGT6 (U16.112), Ports (J8.1)
PC12: STM32F407ZGT6 (U16.113), Ports (J8.5)
PC13: STM32F407ZGT6 (U16.7), Ports (P4.12)
PD2: STM32F407ZGT6 (U16.116), Ports (J8.2)
PD3: STM32F407ZGT6 (U16.117), Ports (J8.3)
PD6: STM32F407ZGT6 (U16.122), Ports (J5.9)
PD7: STM32F407ZGT6 (U16.123), Ports (J5.2)
PE0: STM32F407ZGT6 (U16.141), Ports (P4.23)
PE1: STM32F407ZGT6 (U16.142), Ports (P4.20)
PE2: STM32F407ZGT6 (U16.1), Ports (P4.19)
PE3: STM32F407ZGT6 (U16.2), Ports (P4.18)
PE4: STM32F407ZGT6 (U16.3), Ports (P4.17)
PE5: STM32F407ZGT6 (U16.4), Ports (P4.14)
PE6: STM32F407ZGT6 (U16.5), Ports (P4.13)
PF0: STM32F407ZGT6 (U16.10), Ports (P4.11)
PF1: STM32F407ZGT6 (U16.11), Ports (P4.8)
PF2: STM32F407ZGT6 (U16.12), Ports (P4.7)
PF3: STM32F407ZGT6 (U16.13), Ports (P4.6)
PF4: STM32F407ZGT6 (U16.14), Ports (P4.5)
PF5: STM32F407ZGT6 (U16.15), Ports (P4.2)
PF6: STM32F407ZGT6 (U16.18), Ports (P4.1)
PF11: STM32F407ZGT6 (U16.49), Ports (R31.3)
PF12: STM32F407ZGT6 (U16.50), Ports (R31.4)
PF13: STM32F407ZGT6 (U16.53), Ports (J10.6)
PG2: STM32F407ZGT6 (U16.87), Ports (J6.10)
PG3: STM32F407ZGT6 (U16.88), Ports (J6.9)
PG4: STM32F407ZGT6 (U16.89), Ports (J6.2)
PG5: STM32F407ZGT6 (U16.90), Ports (J6.8)
PG6: STM32F407ZGT6 (U16.91), Ports (J6.3)
PG7: STM32F407ZGT6 (U16.92), Ports (J6.7)
PG8: STM32F407ZGT6 (U16.93), Ports (J6.4)
PG9: STM32F407ZGT6 (U16.124), Ports (J5.8)
PG10: STM32F407ZGT6 (U16.125), Ports (J5.3)
PG11: STM32F407ZGT6 (U16.126), Ports (J5.7)
PG13: STM32F407ZGT6 (U16.128), Ports (J5.4)
PG14: STM32F407ZGT6 (U16.129), Ports (J5.5)
PG15: STM32F407ZGT6 (U16.132), Ports (J7.1)
U1_RX: Power (R37.1), STM32F407ZGT6 (U16.102)
U1_TX: Power (R38.1), STM32F407ZGT6 (U16.101)
U2_RX: STM32F407ZGT6 (U16.37), Ports (R32.1)
U2_TX: STM32F407ZGT6 (U16.36), Ports (R32.2)
U3_RX: STM32F407ZGT6 (U16.70), Ports (R31.1)
U3_TX: STM32F407ZGT6 (U16.69), Ports (R31.2)